# Altium project PCB_PROJECT1.PRJPCB
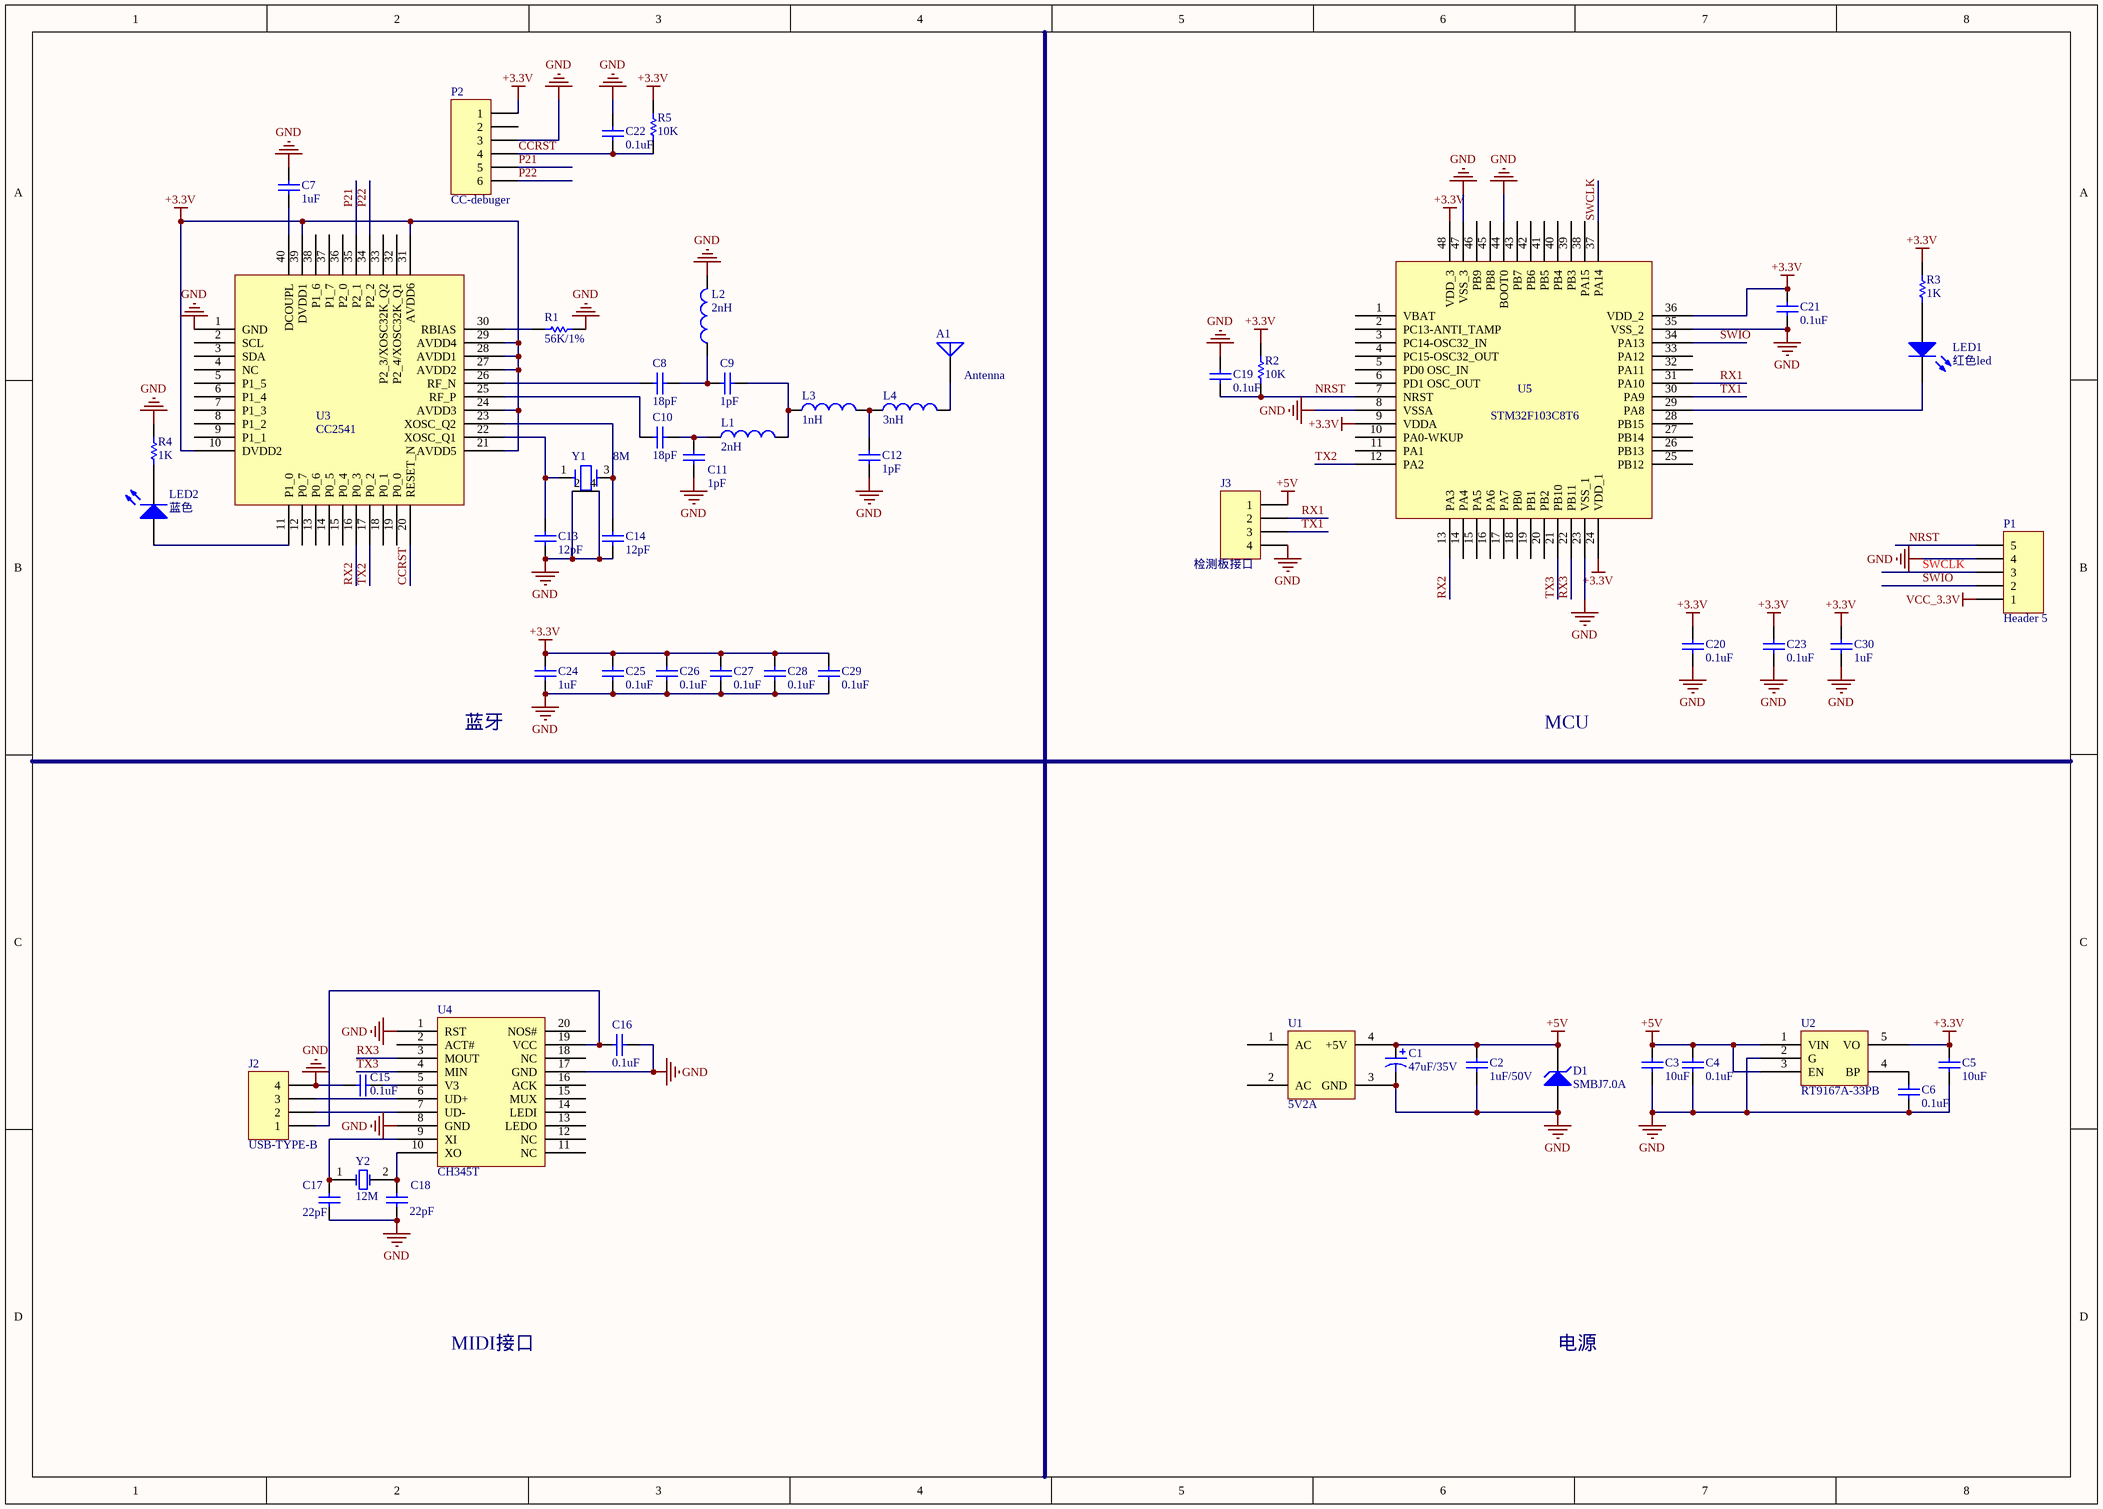
[diagram p0: SHEET1.SCHDOC]
1 sheet, 54 parts. Net scope: global (net labels, ports and power ports of the same name join across sheets).
Board file: PCB1.PcbDoc

## Sheet SHEET1.SCHDOC
size A3

### Parts
A1  Antenna  [ANT-PCB-2.4G-IFA-AN043-TI-ORIGIN]
C1  47uF/35V  [A]
C2  1uF/50V  [0805]
C3  10uF  [0805]
C4  0.1uF  [0603]
C5  10uF  [0805]
C6  0.1uF  [0603]
C7  1uF  [0603]
C8  18pF  [0402_SMALL]
C9  1pF  [0402_SMALL]
C10  18pF  [0402_SMALL]
C11  1pF  [0402_SMALL]
C12  1pF  [0402_SMALL]
C13  12pF  [0402_SMALL]
C14  12pF  [0402_SMALL]
C15  0.1uF  [0603]
C16  0.1uF  [0603]
C17  22pF  [0603]
C18  22pF  [0603]
C19  0.1uF  [0603]
C20  0.1uF  [0603]
C21  0.1uF  [0603]
C22  0.1uF  [0603]
C23  0.1uF  [0603]
C24  1uF  [0603]
C25  0.1uF  [0603]
C26  0.1uF  [0603]
C27  0.1uF  [0603]
C28  0.1uF  [0603]
C29  0.1uF  [0603]
C30  1uF  [0603]
D1  SMBJ7.0A  [SMD4148]
J2  USB-TYPE-B  [USB_TYPEB]
J3  检测板接口  [USBA]
L1  2nH  [0402_SMALL]
L2  2nH  [0402_SMALL]
L3  1nH  [0402_SMALL]
L4  3nH  [0402_SMALL]
LED1  红色led  [PIN2]
LED2  蓝色  [PIN2]
P1  Header 5  [5X1.25MMWS]
P2  CC-debuger  [MHDR1X6]
R1  56K/1%  [0402_SMALL]
R2  10K  [0603]
R3  1K  [0603]
R4  1K  [0402_SMALL]
R5  10K  [0603]
U1  5V2A  [ACDV5V]
U2  RT9167A-33PB  [SOT-23-5]
U3  CC2541  [QFN50P600X600X80-40N]
U4  CH345T  [SSOP20]
U5  STM32F103C8T6  [LQFP48]
Y1  8M  [XTAL4TN_3225]
Y2  12M  [XTAL1]

### Nets
+3.3V: C5.1 C20.1 C21.1 C23.1 C24.1 C25.1 C26.1 C27.1 C28.1 C29.1 C30.1 P2.1 R2.2 R3.2 R5.2 U2.5(VO) U3.10(DVDD2) U3.21(AVDD5) U3.24(AVDD3) U3.27(AVDD2) U3.28(AVDD1) U3.29(AVDD4) U3.31(AVDD6) U3.39(DVDD1) U5.9(VDDA) U5.24(VDD_1) U5.36(VDD_2) U5.48(VDD_3)
+5V: C1.1 C2.1 C3.1 C4.2 D1.2(K) J3.1 U1.4(+5V) U2.1(VIN) U2.3(EN)
GND: C1.2 C2.2 C3.2 C4.1 C5.2 C6.1 C7.2 C11.1 C12.1 C13.2 C14.2 C15.2 C16.1 C17.2 C18.2 C19.1 C20.2 C21.2 C22.1 C23.2 C24.2 C25.2 C26.2 C27.2 C28.2 C29.2 C30.2 D1.1(A) J2.4 J3.4 L2.2 P1.4 P2.3 R1.2 R4.1 U1.3(GND) U2.2(G) U3.1(GND) U4.1(RST) U4.8(GND) U4.17(GND) U5.8(VSSA) U5.23(VSS_1) U5.35(VSS_2) U5.44(BOOT0) U5.47(VSS_3) Y1.2(GND) Y1.4(GND)
VCC_3.3V: P1.1
CCRST: C22.2 P2.4 R5.1 U3.20(RESET_N)
NRST: C19.2 P1.5 R2.1 U5.7(NRST)
P21: P2.5 U3.35(P2_1)
P22: P2.6 U3.34(P2_2)
RX1: J3.2 U5.31(PA10)
RX2: U3.16(P0_3) U5.13(PA3)
RX3: U4.3(MOUT) U5.22(PB11)
SWCLK: P1.3 U5.37(PA14)
SWIO: P1.2 U5.34(PA13)
TX1: J3.3 U5.30(PA9)
TX2: U3.17(P0_2) U5.12(PA2)
TX3: U4.4(MIN) U5.21(PB10)
NetA1_1: A1.1(A) L4.2
NetC6_2: C6.2 U2.4(BP)
NetC7_1: C7.1 U3.40(DCOUPL)
NetC8_1: C8.1 C9.2 L2.1
NetC8_2: C8.2 U3.26(RF_N)
NetC9_1: C9.1 L1.2 L3.1
NetC10_1: C10.1 C11.2 L1.1
NetC10_2: C10.2 U3.25(RF_P)
NetC12_2: C12.2 L3.2 L4.1
NetC13_1: C13.1 U3.22(XOSC_Q1) Y1.1(X1)
NetC14_1: C14.1 U3.23(XOSC_Q2) Y1.3(X2)
NetC15_1: C15.1 U4.5(V3)
NetC16_2: C16.2 J2.1 U4.19(VCC)
NetC17_1: C17.1 U4.9(XI) Y2.1(OSC1)
NetC18_1: C18.1 U4.10(XO) Y2.2(OSC2)
NetJ2_2: J2.2 U4.7(UD-)
NetJ2_3: J2.3 U4.6(UD+)
NetLED1_1: LED1.1(A) R3.1
NetLED1_2: LED1.2(K) U5.29(PA8)
NetLED2_1: LED2.1(A) U3.11(P1_0)
NetLED2_2: LED2.2(K) R4.2
NetR1_1: R1.1 U3.30(RBIAS)

Not connected (* = marked no-connect by the designer): P2 2; U1 1(AC) 2(AC); U3 2(SCL) 3(SDA) 4(NC) 5(P1_5) 6(P1_4) 7(P1_3) 8(P1_2) 9(P1_1) 12(P0_7) 13(P0_6) 14(P0_5) 15(P0_4) 18(P0_1) 19(P0_0) 32(P2_4/XOSC32K_Q1) 33(P2_3/XOSC32K_Q2) 36(P2_0) 37(P1_7) 38(P1_6); U4 2(ACT#) 11(NC) 12(NC) 13(LEDO) 14(LEDI) 15(MUX) 16(ACK) 18(NC) 20(NOS#); U5 1(VBAT) 2(PC13-ANTI_TAMP) 3(PC14-OSC32_IN) 4(PC15-OSC32_OUT) 5(PD0_OSC_IN) 6(PD1_OSC_OUT) 10(PA0-WKUP) 11(PA1) 14(PA4) 15(PA5) 16(PA6) 17(PA7) 18(PB0) 19(PB1) 20(PB2) 25(PB12) 26(PB13) 27(PB14) 28(PB15) 32(PA11) 33(PA12) 38(PA15) 39(PB3) 40(PB4) 41(PB5) 42(PB6) 43(PB7) 45(PB8) 46(PB9)

### Notes on the sheet
- 蓝牙
- MCU
- MIDI接口
- 电源

### Library data of the parts
A1 = Antenna: Generic Antenna; Published: 24-Mar-1999; LatestRevisionDate: 17-Jul-2002; LatestRevisionNote: Re-released for DXP Platform.; PackageReference: PIN1; Publisher: Altium Limited
C1 = Cap Pol1: Polarized Capacitor (Radial); Value: 100pF; Published: 8-Jun-2000; LatestRevisionDate: 17-Jul-2002; LatestRevisionNote: Re-released for DXP Platform.; PackageReference: RB7.6-15; Publisher: Altium Limited
C2-C30 = Cap: Capacitor; Value: 100pF; Published: 8-Jun-2000; LatestRevisionDate: 17-Jul-2002; LatestRevisionNote: Re-released for DXP Platform.; PackageReference: RAD-0.3; Publisher: Altium Limited
D1 = D Zener: Zener Diode; Published: 8-Jun-2000; LatestRevisionDate: 17-Jul-2002; LatestRevisionNote: Re-released for DXP Platform.; PackageReference: DIODE-0.7; Publisher: Altium Limited
J2 J3 = Header 4: Header, 4-Pin; LatestRevisionDate: 17-Jul-2002; LatestRevisionNote: Re-released for DXP Platform.; Publisher: Altium Limited
L1-L4 = Inductor: Code_IEC: 1005; Value: 10mH; Published: 8-Jun-2000; LatestRevisionDate: 17-Jul-2002; LatestRevisionNote: Re-released for DXP Platform.; PackageReference: 0402-A; Publisher: Altium Limited; Code_JEITA: 0402
LED1 LED2 = LED0: Typical INFRARED GaAs LED; Published: 8-Jun-2000; LatestRevisionDate: 08-Jul-2005; LatestRevisionNote: Mech Layer 1 removed.; PackageReference: LED-0; Publisher: Altium Limited
P1 = Header 5: Header, 5-Pin; LatestRevisionDate: 17-Jul-2002; LatestRevisionNote: Re-released for DXP Platform.; Publisher: Altium Limited
P2 = Header 6: Header, 6-Pin; LatestRevisionDate: 17-Jul-2002; LatestRevisionNote: Re-released for DXP Platform.; Publisher: Altium Limited
R1 R2 R5 = Res Semi: Semiconductor Resistor; Value: 1K; Published: 8-Jun-2000; LatestRevisionDate: 17-Jul-2002; LatestRevisionNote: Re-released for DXP Platform.; PackageReference: AXIAL-0.5; Publisher: Altium Limited
R3 R4 = Res Semi: Semiconductor Resistor; Published: 8-Jun-2000; LatestRevisionDate: 17-Jul-2002; LatestRevisionNote: Re-released for DXP Platform.; PackageReference: AXIAL-0.5; Publisher: Altium Limited; Value: 1K
Y1 = CRYSTAL-4
Y2 = XTAL: Crystal Oscillator; Published: 8-Jun-2000; LatestRevisionDate: 17-Jul-2002; LatestRevisionNote: Re-released for DXP Platform.; PackageReference: R38; Publisher: Altium Limited